# EAGLE board node6.9.14-frontend (EAGLE 5.10), part 1 of 2
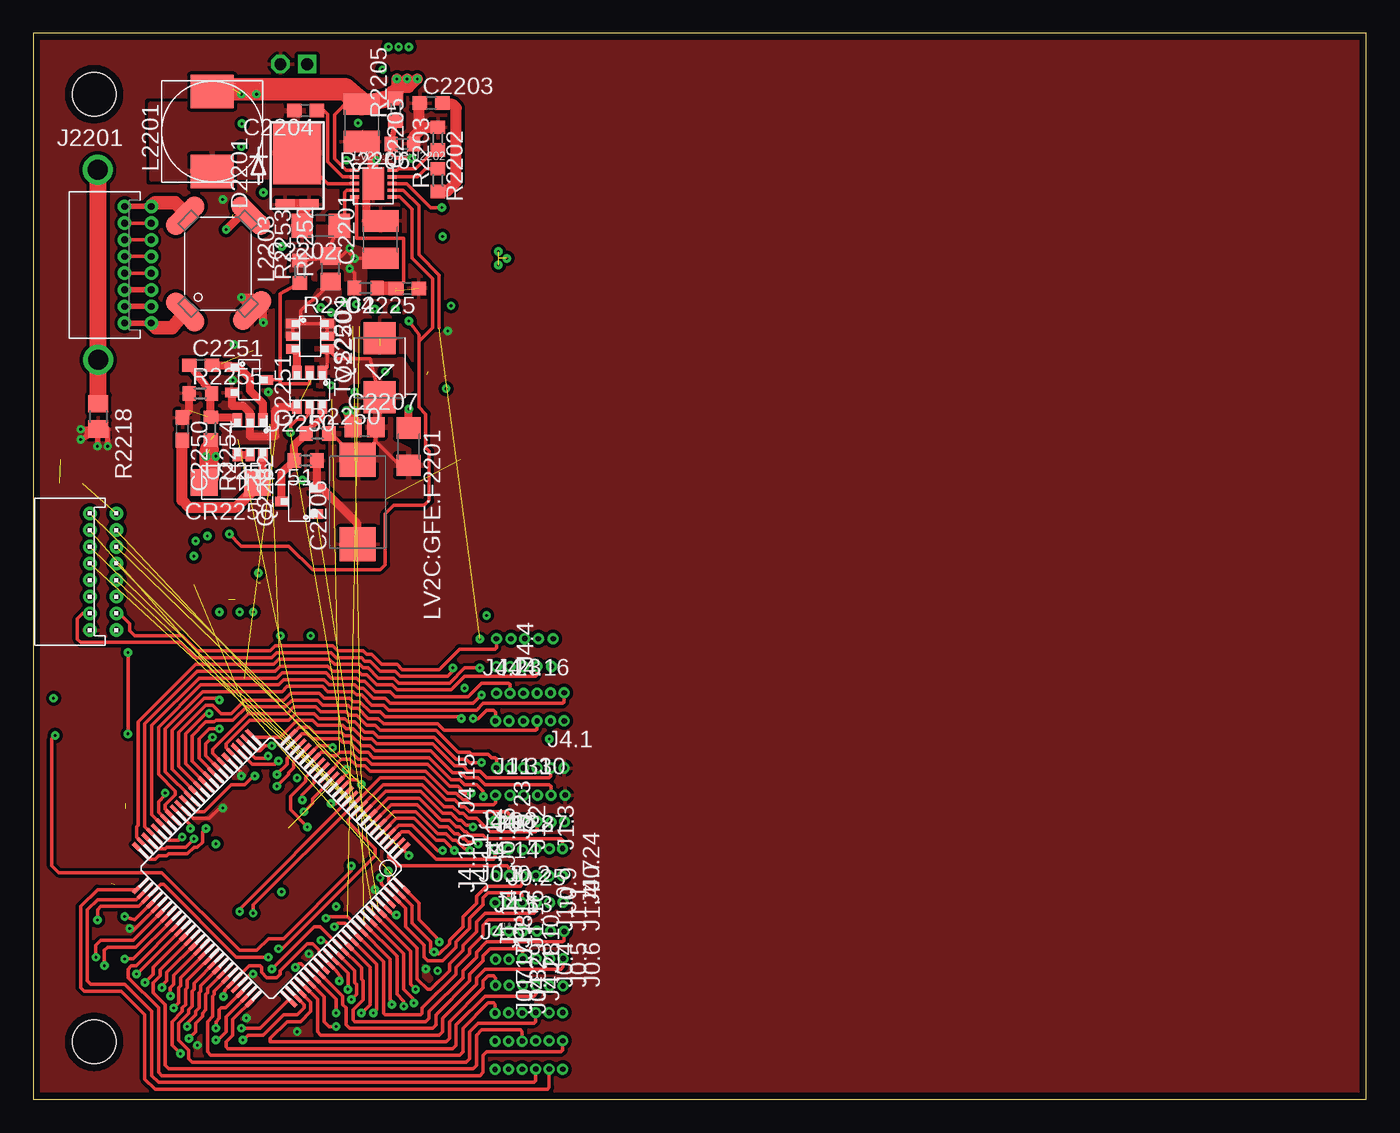
[diagram p2: board, top side]
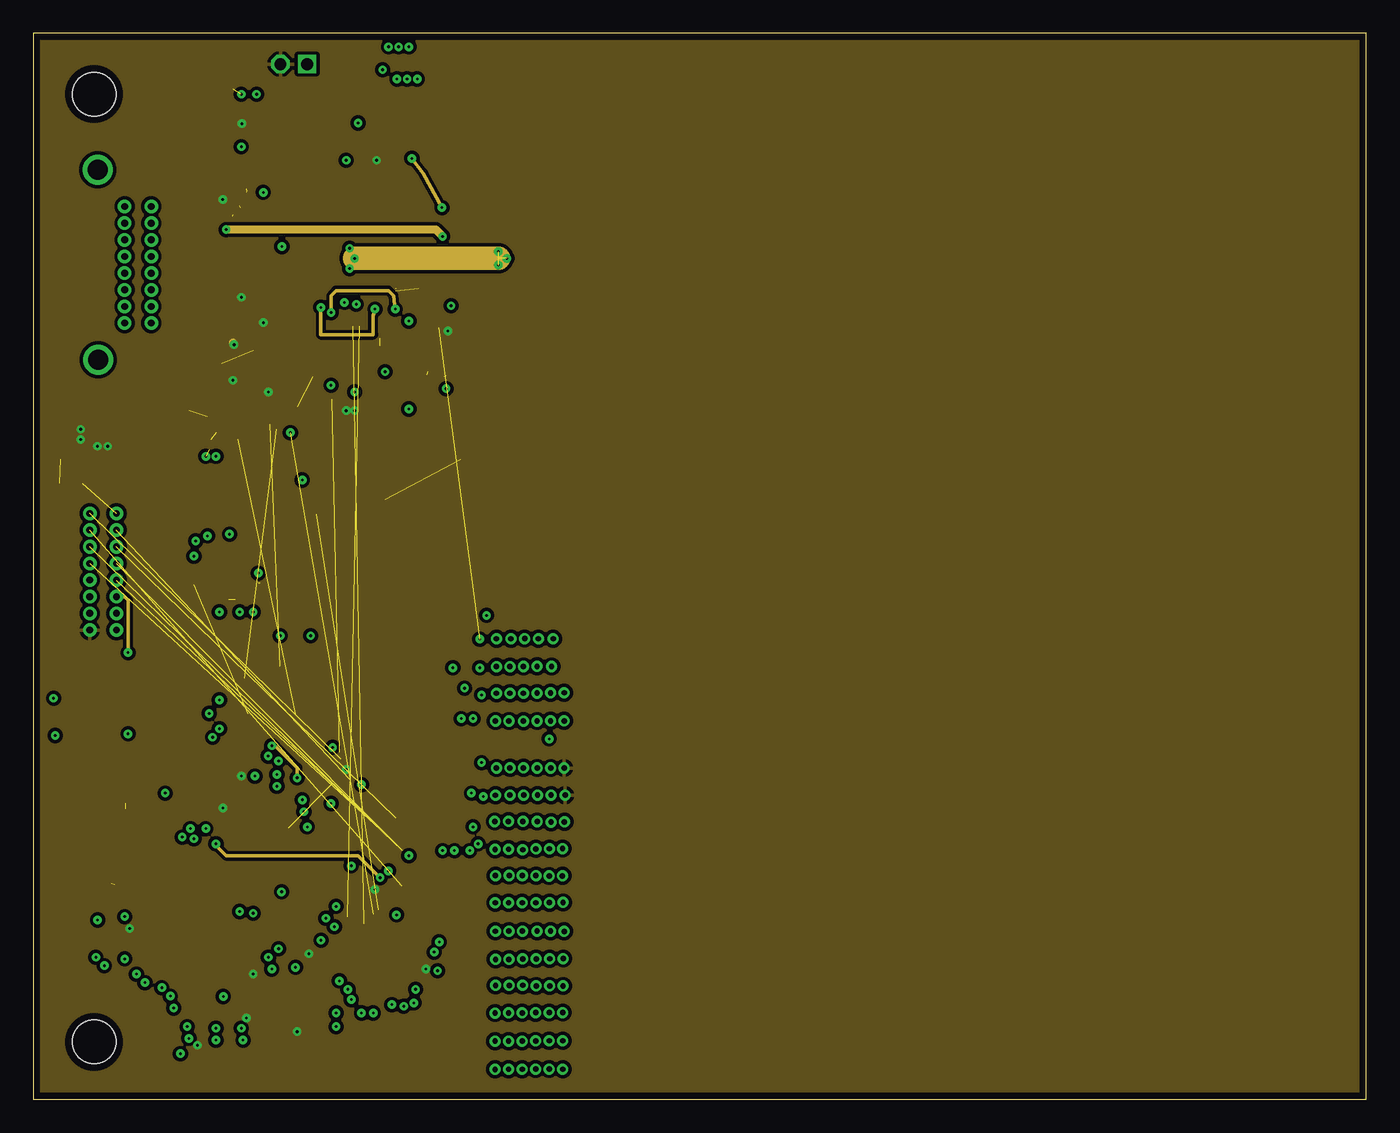
[diagram p3: board, inner layer Route2]
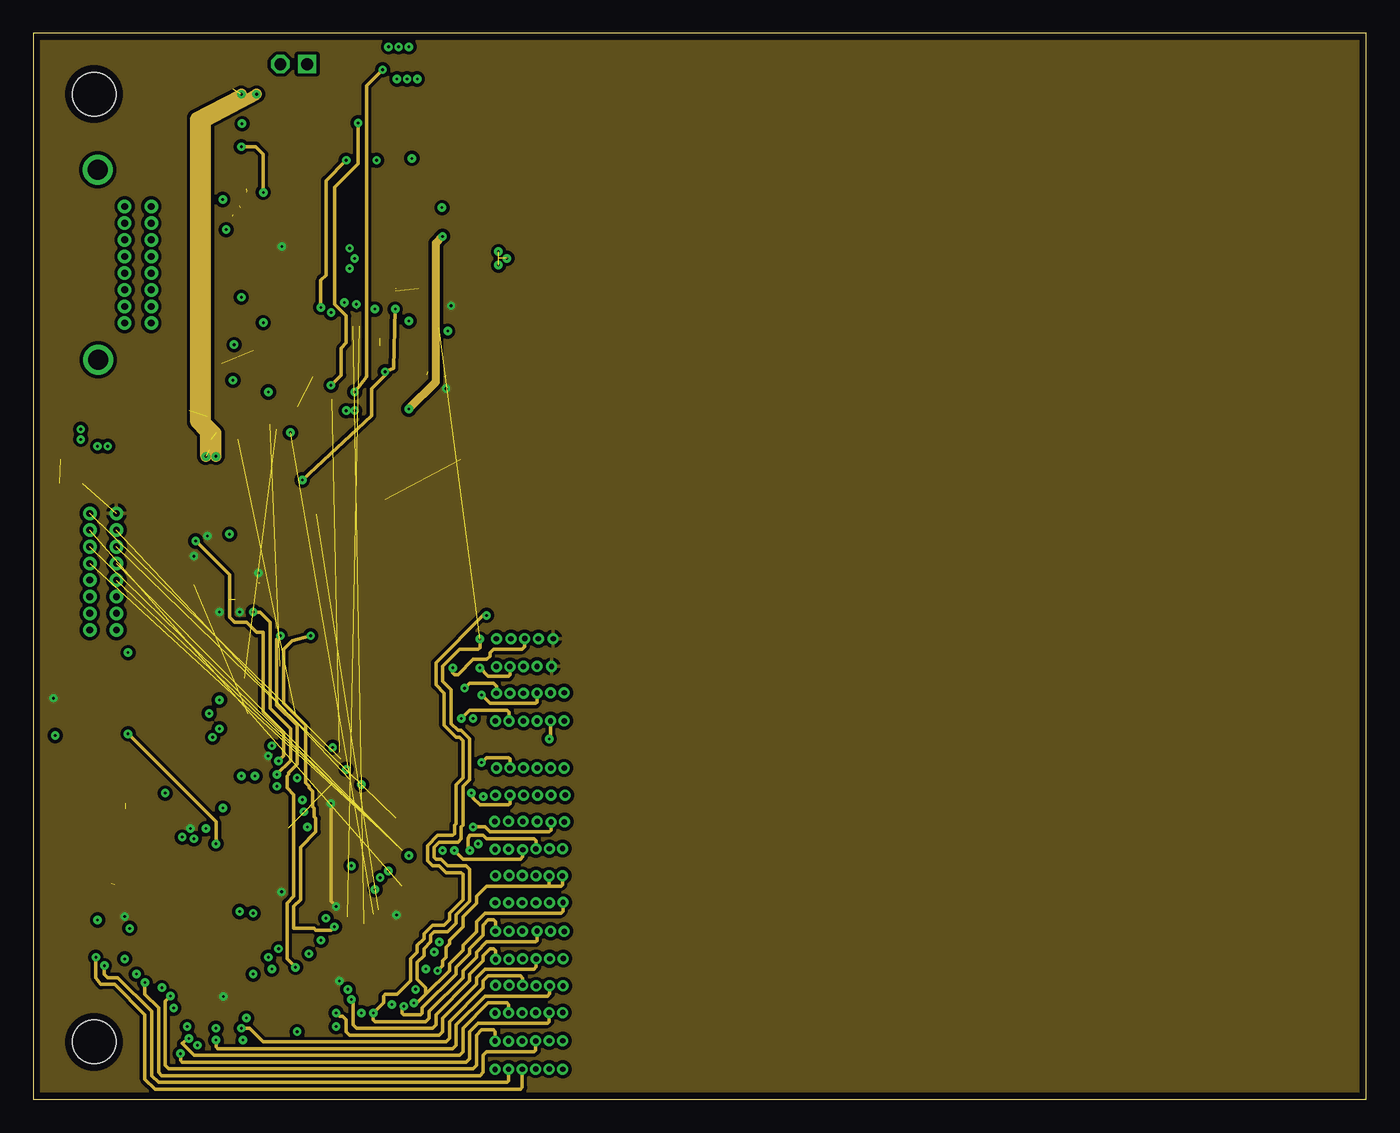
[diagram p4: board, inner layer Route15]
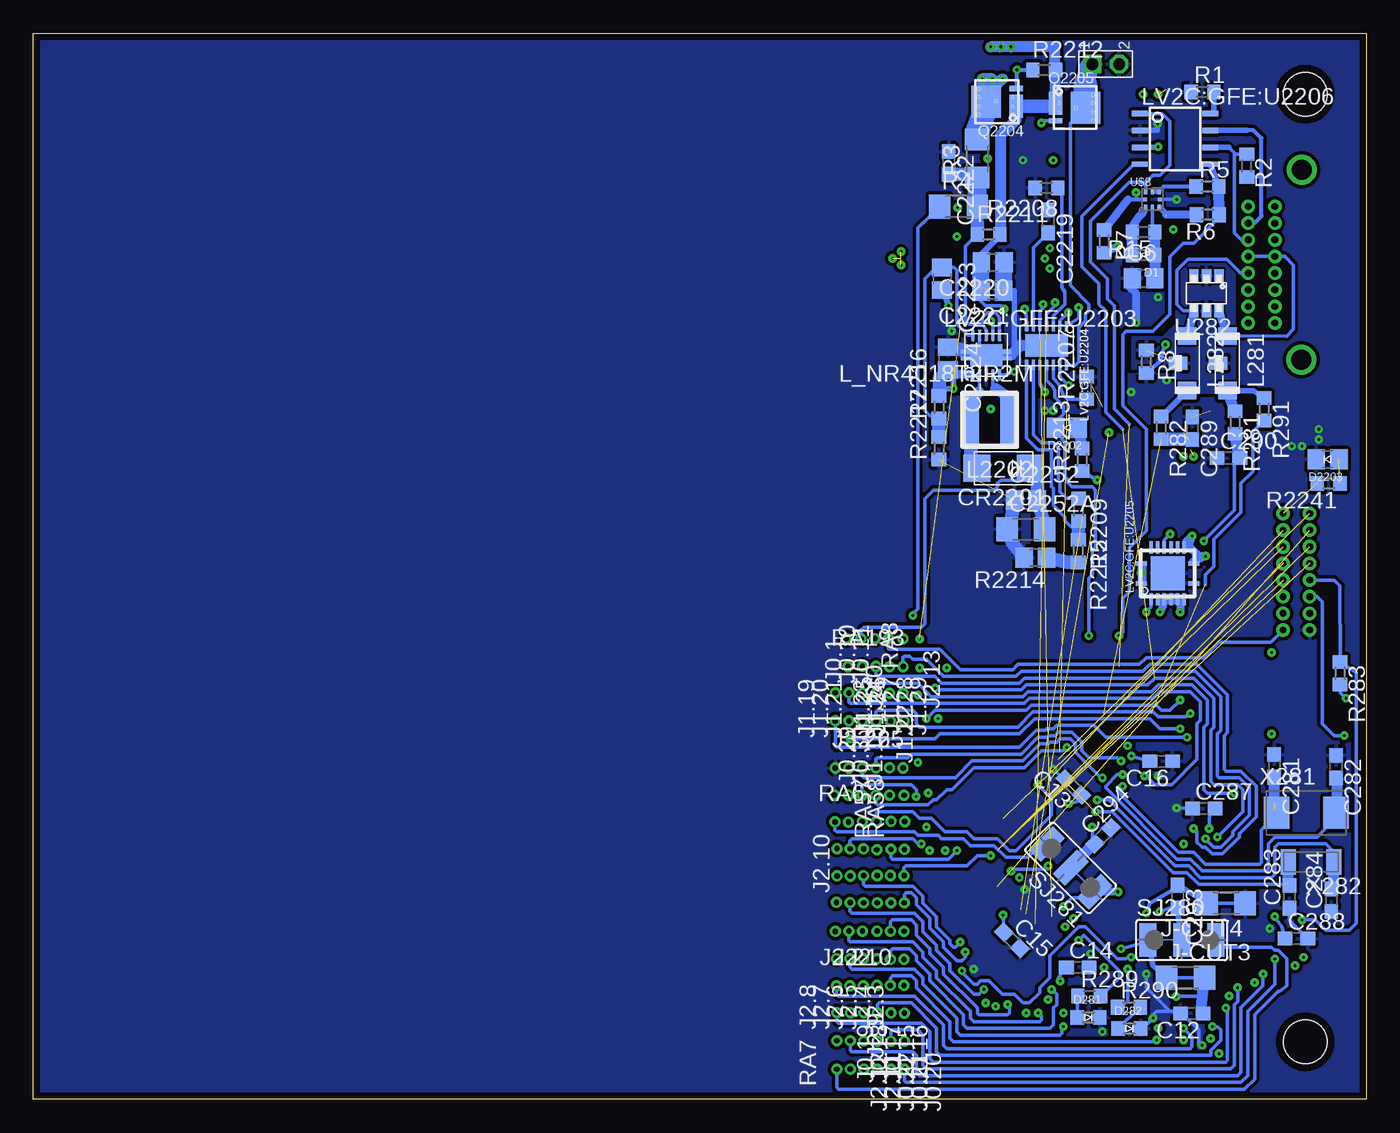
[diagram p5: board, bottom side, seen from below]

Size 100.08 x 80.01 mm. Coordinates in mm from the lower left corner, seen from the top.
Outline: 0,0 100.08,0 100.08,80.01 0,80 0,0
Copper layers (1+2*15+16): Top 0.0432mm / dielectric 0.3048mm / Route2 0.0356mm / dielectric 0.7112mm / Route15 0.0356mm / dielectric 0.3023mm / Bottom 0.0432mm
Design rules "sunstone_4lr_rules_v1.3_modifid *": minimum track width 6mil, minimum drill 8mil, track to track 6mil, track to pad 6mil, pad to pad 6mil, via to via 6mil, smd to smd 6mil, copper to edge 20mil, drill to drill 16mil, minimum pad ring 0.2118mm, minimum via ring 0.2118mm, stop-mask expansion 3mil, vias tented up to drill 0mil, thermal gap 10mil

## Footprints (pad centres in the part's own frame; a part is rotated, then mirrored left to right if it is on the bottom)
2MM-1X2-HEADER = drill 0.889 pad 1.372 square: 1 0,-1 | drill 0.889 pad 1.372 octagon: 2 0,1
C0805 = smd 1.3 x 1.5: 1 -0.85,0; 2 0.85,0
C0603 = smd 1.1 x 1: 1 -0.85,0; 2 0.85,0
C1210 = smd 1.6 x 2.7: 1 -1.4,0; 2 1.4,0
C1206 = smd 1.6 x 1.8: 1 -1.4,0; 2 1.4,0
D/7343-31R = smd 2.55 x 2.7: + 3.175,0; - -3.175,0
NMINIP2-J1 = smd 2 x 2: A 2,0; C -2,0
0603-DIODE = smd 1 x 1.1: A -0.85,0; K 0.85,0
D_POWERDI5 = smd 0.8 x 1.4: ANODE1 -3.47,-0.8; ANODE2 -3.47,1 | smd 4.7 x 3.6: CATHODE 0.4,0.1
0805-DIODE = smd 1.3 x 1.5: 1(ANODE) -0.85,0; 2(CATHODE) 0.85,0
0805-DIODE@1 = smd 1.3 x 1.5: 1(ANODE) -0.85,0; 2(CATHODE) 0.85,0
PAD_ROUND-APC-FREE_0.1/016 = drill 0.406 round: PAD 0,0
ROCKETBUS-PKG = drill 0.508 pad 1.016 round: AUX_1@1 0,-1.875; AUX_1@2 2,-1.875; AUX_2@1 0,-3.125; AUX_2@2 2,-3.125; B+@1 0,4.375; B+@2 2,4.375; B-@1 0,-4.375; B-@2 2,-4.375; CAN_H@1 0,3.125; CAN_H@2 2,3.125; CAN_L@1 0,1.875; CAN_L@2 2,1.875; USB_H@1 0,0.625; USB_H@2 2,0.625; USB_L@1 0,-0.625; USB_L@2 2,-0.625 | drill 1.511 round: CHASSIS@1 -2.032,7.136; CHASSIS@2 -1.982,-7.136
JST-16PS-JED = drill 0.508 pad 1.016 round: 1 4.375,-2; 2 4.375,0; 3 3.125,-2; 4 3.125,0; 5 1.875,-2; 6 1.875,0; 7 0.625,-2; 8 0.625,0; 9 -0.625,-2; 10 -0.625,0; 11 -1.875,-2; 12 -1.875,0; 13 -3.125,-2; 14 -3.125,0; 15 -4.375,-2; 16 -4.375,0
ZJ1206B = smd 1.6 x 1.803: 1 -1.422,0; 2 1.422,0
STAND-OFF = hole 3.302: 0,0
EXC-CET@1 = smd 1.3 x 1.4: 1 -2.05,0; 2 2.05,0 | smd 1 x 1.4: C 0,-0.7
L-DR74 = smd 2.5 x 3.25: 1 -3,0; 2 3,0
L_NR4018 = smd 1.2 x 3.7: 1 -1.4,0; 2 1.4,0
CMS1 = smd 3.5 x 1.5 rotated 45: 1 3.608,-2.462; 3 -3.608,2.462 | smd 3.5 x 1.5 rotated 315: 2 3.508,2.562; 4 -3.608,-2.462
1206 = smd 1.6 x 1.8: 1 -1.4,0; 2 1.4,0
LQFP100 = smd 0.28 x 1.5: #RESET 2,-7.9; #RSTOUT 0.5,-7.9; #TRST -4.5,-7.9; P0[15]/TXD1/SCK0/SCK 0.5,7.9; P0[16]/RXD1/SSEL0/SSEL 0,7.9; P0[17]/CTS1/MISO0/MISO 1,7.9; P0[18]/DCD1/MOSI0/MOSI 1.5,7.9; P0[19]/DSR1/MCICLK/SDA1 2,7.9; P0[20]/DTR1/MCICMD/SCL1 2.5,7.9; P0[21]/RI1/MCIPWR/RD1 3,7.9; P0[22]/RTS1/MCIDAT0/TD1 3.5,7.9; P0[23]/AD0[0]/I2SRX_CLK/CAP3[0] -2,-7.9; P0[24]/AD0[1]/I2SRX_WS/CAP3[1] -2.5,-7.9; P0[25]/AD0[2]/I2SRX_SDA/TXD3 -3,-7.9; P0[26]/AD0[3]/AOUT/RXD3 -3.5,-7.9; P0[27]/SDA0 6,-7.9; P0[28]/SCL0 5.5,-7.9; P1[30]/VBUS/AD0[4] 4,-7.9; P1[31]/SCK1/AD0[5] 3.5,-7.9; P2[0]/PWM1[1]/TXD1/TRACECLK -6,7.9; P2[1]/PWM1[2]/RXD1/PIPESTAT0 -5.5,7.9; P2[2]/PWM1[3]/CTS1/PIPESTAT1 -5,7.9; P2[3]/PWM1[4]/DCD1/PIPESTAT2 -3.5,7.9; P2[4]/PWM1[5]/DSR1/TRACESYNC -3,7.9; P2[5]/PWM1[6]/DTR1/TRACEPKT0 -2.5,7.9; P2[6]/PCAP1[0]/RI1/TRACEPKT1 -2,7.9; P2[7]/RD2/RTS1/TRACEPKT2 -1.5,7.9; P2[8]/TD2/TXD2/TRACEPKT3 -1,7.9; P2[9]/USB_CONNECT/RXD2/EXTIN0 -0.5,7.9; P2[10]/#EINT0 5,7.9; P2[11]/#EINT1/MCIDAT1/I2STX_CLK 5.5,7.9; P2[12]/#EINT2/MCIDAT2/I2STX_WS 6,7.9; RTCX1 1.5,-7.9; RTCX2 2.5,-7.9; TCK -4,-7.9; TDI -5.5,-7.9; TDO -6,-7.9; TMS -5,-7.9; VBAT 3,-7.9; VDD(3V3)@1 4.5,7.9; VDD(3V3)@2 -4,7.9; VDD(DCDC)(3V3) 0,-7.9; VDDA -1.5,-7.9; VREF -0.5,-7.9; VSS 1,-7.9; VSS@3 4,7.9; VSS@4 -4.5,7.9; VSSA -1,-7.9; XTAL1 4.5,-7.9; XTAL2 5,-7.9 | smd 1.5 x 0.28: P0[0]/RD1/TXD3/SDA1 7.9,4; P0[1]/TD1/RXD3/SCL1 7.9,4.5; P0[2]/TXD0 -7.9,-5; P0[3]/RXD0 -7.9,-5.5; P0[4]/I2SRX_CLK/RD2/CAP2[0] -7.9,3.5; P0[5]/I2SRX_WS/TD2/CAP2[1] -7.9,4; P0[6]/I2SRX_SDA/SSEL1/MAT2[0] -7.9,4.5; P0[7]/I2STX_CLK/SCK1/MAT2[1] -7.9,5; P0[8]/I2STX_WS/MISO1/MAT2[2] -7.9,5.5; P0[9]/I2STX_SDA/MOSI1/MAT2[3] -7.9,6; P0[10]/TXD2/SDA2/MAT3[0] 7.9,5; P0[11]/RXD2/SCL2/MAT3[1] 7.9,5.5; P0[29]/USB_D+ 7.9,-4.5; P0[30]/USB_D- 7.9,-4; P1[0]/ENET_TXD0 -7.9,-3.5; P1[1]/ENET_TXD1 -7.9,-3; P1[4]/ENET_TX_EN -7.9,-2.5; P1[8]/ENET_CRS -7.9,-2; P1[9]/ENET_RXD0 -7.9,-1.5; P1[10]/ENET_RXD1 -7.9,-1; P1[14]/ENET_RX_ER -7.9,-0.5; P1[15]/ENET_REF_CLK -7.9,0; P1[16]/ENET_MDC -7.9,0.5; P1[17]/ENET_MDIO -7.9,1; P1[18]/USB_UP_LED/PWM1[1]/CAP1[0] 7.9,-3; P1[19]/CAP1[1] 7.9,-2.5; P1[20]/PWM1[2]/SCK0 7.9,-2; P1[21]/PWM1[3]/SSEL0 7.9,-1.5; P1[22]MAT1[0] 7.9,-1; P1[23]/PWM1[4]/MISO0 7.9,-0.5; P1[24]/PWM1[5]/MOSI0 7.9,0; P1[25]/MAT1[1] 7.9,0.5; P1[26]/PWM1[6]/CAP0[0] 7.9,1; P1[27]/CAP0[1] 7.9,2.5; P1[28]/PCAP1[0]/MAT0[0] 7.9,3; P1[29]/PCAP1[1]/MAT0[1] 7.9,3.5; P2[13]/#EINT3/MCIDAT3/I2STX_SDA 7.9,6; P3[25]/MAT0[0]/PWM1[2] 7.9,-5.5; P3[26]/MAT0[1]/PWM1[3] 7.9,-6; P4[28]/MAT2[0]/TXD3 -7.9,3; P4[29]/MAT2[1]/RXD3 -7.9,1.5; RTCK -7.9,-6; VDD(3V3) 7.9,-5; VDD(3V3)@3 -7.9,-4; VDD(DCDC)(3V3)@1 7.9,2; VDD(DCDC)(3V3)@2 -7.9,2; VSS@1 7.9,-3.5; VSS@2 7.9,1.5; VSS@5 -7.9,-4.5; VSS@6 -7.9,2.5
DFN-10 = smd 0.25 x 0.675: BD -1,-1.413; BOOST -0.5,-1.413; FB 0,1.413; PG 0.5,1.413; RT -1,1.413; RUN/SS 1,-1.413; SW 0,-1.413; SYNC 1,1.413; VC -0.5,1.413; VIN 0.5,-1.413 | smd 2.38 x 1.65: GND 0,0
SON-10 = smd 0.28 x 0.85: EN 1,1.475; FB -1,1.475; GND -0.5,1.475; L1 0.5,-1.475; L2 -0.5,-1.475; PGND 0,-1.475; PS/SYNC 0.5,1.475; VIN 1,-1.475; VINA 0,1.475; VOUT -1,-1.475 | smd 2.4 x 1.65: PGND@1 0,0 | smd 3.8 x 0.28: PGND@2 0,0.25; PGND@3 0,-0.25
DFN-14 = smd 0.25 x 0.7: 1 -1.5,-1.45; 2 -1,-1.45; 3 -0.5,-1.45; 4 0,-1.45; 5 0.5,-1.45; 6 1,-1.45; 7 1.5,-1.45; 8 1.5,1.45; 9 1,1.45; 10 0.5,1.45; 11 0,1.45; 12 -0.5,1.45; 13 -1,1.45; 14 -1.5,1.45 | smd 3.3 x 1.7: PGND 0,0
QFN-16 = smd 0.85 x 0.28: 1 -1.97,-0.75; 8 1.97,-0.74; 9 1.97,0.75; 16 -1.98,0.75 | smd 0.28 x 0.85: 2 -1.25,-1.95; 3 -0.75,-1.95; 4 -0.25,-1.95; 5 0.25,-1.95; 6 0.75,-1.95; 7 1.25,-1.95; 10 1.25,1.95; 11 0.75,1.95; 12 0.25,1.95; 13 -0.25,1.95; 14 -0.75,1.95; 15 -1.25,1.95 | smd 2.55 x 2.55: PGND 0,0
DR-PDSO-G8 = smd 0.4 x 1.2: 1 -1.905,-2.65; 2 -0.635,-2.65; 3 0.635,-2.65; 4 1.905,-2.65; 5 1.905,2.65; 6 0.635,2.65; 7 -0.635,2.65; 8 -1.905,2.65
1212-8_POWERPAK = smd 0.99 x 1.725: 1-2-3 -1.45,0.33 | smd 0.99 x 0.405: 4 -1.45,-0.99 | smd 2.24 x 2.39: 5-6-7-8 0.797,0
SOT23-6 = smd 0.7 x 1: 1 -0.95,-1.3; 2 0,-1.3; 3 0.95,-1.3; 4 0.95,1.3; 5 0,1.3; 6 -0.95,1.3
SOT23-3 = smd 0.7 x 1: 1 -0.95,-1.3; 2 0.95,-1.3; 3 0,1.3
R0603 = smd 1 x 1.1: 1 -0.85,0; 2 0.85,0
R1206 = smd 1.6 x 1.803: 1 -1.422,0; 2 1.422,0
R0805 = smd 1.3 x 1.5: 1 -0.85,0; 2 0.85,0
R0805' = smd 1.3 x 1.5: 1 -0.95,0; 2 0.95,0
SJ_2W = smd 1.27 x 2.54: 1 -2.54,0; 2 0,0; 3 2.54,0
SMB = smd 2.4 x 2.4: A 2.2,0; C -2.2,0
MICROPAK-8 = smd 0.25 x 0.4: 1 -0.5,-0.61; 2 0,-0.61; 3 0.5,-0.61; 5 0.5,0.61; 6 0,0.61; 7 -0.5,0.61 | smd 0.4 x 0.25: 4 0.6,0; 8 -0.6,0
CS10 = smd 1.905 x 2.413: P$1 -2.235,0; P$2 2.235,0
CM415 = smd 1.118 x 1.905: P$1 -1.702,0; P$2 1.702,0

## Placement (x,y rotation side)
B1  BATTERY_SINGLE_CELL_2MM  [2MM-1X2-HEADER]  19.56,77.7 270 bottom
C6  76nF  [C0805]  16.71,61.62 0 bottom
C12  0.1  [C0603]  13.09,6.45 180 bottom
C13  0.1  [C0603]  22,23.44 135 bottom
C14  0.1  [C0603]  21.67,9.91 0 bottom
C15  0.1  [C0603]  26.61,11.94 315 bottom
C16  0.1  [C0603]  15.39,25.37 180 bottom
C281  39 pF  [C0603]  6.91,25.02 270 bottom
C282  33 pF  [C0603]  2.26,24.97 270 bottom
C283  22 pF  [C0603]  5.77,15.19 90 bottom
C284  22 pF  [C0603]  2.62,14.94 90 bottom
C287  0.1  [C0603]  12.19,21.82 0 bottom
C288  0.1  [C0603]  5.23,12.06 0 bottom
C289  18pF  [C0603]  13.06,50.37 270 bottom
C290  18pF  [C0603]  10.34,48.13 0 bottom
C293  0.1  [C0603]  14.17,15.21 270 bottom
C294  0.1  [C0603]  19.78,19.77 45 bottom
C2201  10uF  [C1210]  26.06,64.53 90 top
C2202  1uF  [C1206]  21.59,65.56 180 top
C2203  680pF  [C0603]  29.87,74.77 0 top
C2204  0.22uF  [C0603]  20.44,74.22 180 top
C2205  22uF  [C1210]  24.67,73.28 270 top
C2206  22  [D/7343-31R]  24.35,44.83 90 top
C2207  0.33  [C0805]  24.87,50.44 0 top
C2219  depends on bat  [C0603]  23.88,65.89 270 bottom
C2220  4.7uF  [C0805]  28.04,62.81 180 bottom
C2221  4.7uF  [C0805]  28.07,60.71 180 bottom
C2222  0.1uF  [C0603]  31.34,70.28 270 bottom
C2223  2pF  [C0805]  31.85,61.59 270 bottom
C2224  22uF  [C0805]  31.42,55.6 270 bottom
C2225  0.1uF  [C0603]  28.09,60.86 180 top
C2250  2.7  [C0603]  11.2,50.32 270 top
C2251  0.015  [C0603]  12.57,55.09 0 top
C2252  TBD  [C0805]  25.55,44.98 0 bottom
C2252A  TBD  [C1206]  25.55,42.8 0 bottom
CR2201  MA2Q705  [NMINIP2-J1]  27.23,47.37 180 bottom
CR2250  MA2Q705  [NMINIP2-J1]  14.83,46.3 180 top
D1  CDSU101A  [0603-DIODE]  16.71,63.37 180 bottom
D281  LED-RED-0603  [0603-DIODE]  20.85,6.15 0 bottom
D282  LED-GRN-  [0603-DIODE]  17.78,5.31 0 bottom
D2201  D_PDS340  [D_POWERDI5]  19.91,70.63 90 top
D2202  LED-RED-0805  [0805-DIODE]  22.48,50.39 180 bottom
D2203  LED-ORG-0805  [0805-DIODE@1]  2.9,48.03 180 bottom
J0.0  PAD_ROUND016  [PAD_ROUND-APC-FREE_0.1/016]  34.77,30.48 90 bottom
J0.1  PAD_ROUND016  [PAD_ROUND-APC-FREE_0.1/016]  37.82,32.5 90 bottom
J0.2  PAD_ROUND016  [PAD_ROUND-APC-FREE_0.1/016]  36.7,14.76 0 top
J0.3  PAD_ROUND016  [PAD_ROUND-APC-FREE_0.1/016]  34.68,14.76 0 top
J0.4  PAD_ROUND016  [PAD_ROUND-APC-FREE_0.1/016]  37.76,10.54 270 top
J0.5  PAD_ROUND016  [PAD_ROUND-APC-FREE_0.1/016]  38.77,10.55 270 top
J0.6  PAD_ROUND016  [PAD_ROUND-APC-FREE_0.1/016]  39.79,10.57 270 top
J0.7  PAD_ROUND016  [PAD_ROUND-APC-FREE_0.1/016]  34.71,8.55 270 top
J0.8  PAD_ROUND016  [PAD_ROUND-APC-FREE_0.1/016]  35.73,8.55 270 top
J0.9  PAD_ROUND016  [PAD_ROUND-APC-FREE_0.1/016]  36.74,8.56 270 top
J0.10  PAD_ROUND016  [PAD_ROUND-APC-FREE_0.1/016]  36.8,32.49 90 bottom
J0.11  PAD_ROUND016  [PAD_ROUND-APC-FREE_0.1/016]  35.79,32.47 90 bottom
J0.15  PAD_ROUND016  [PAD_ROUND-APC-FREE_0.1/016]  36.7,4.37 270 bottom
J0.16  PAD_ROUND016  [PAD_ROUND-APC-FREE_0.1/016]  35.69,4.37 270 bottom
J0.17  PAD_ROUND016  [PAD_ROUND-APC-FREE_0.1/016]  37.72,4.38 270 bottom
J0.18  PAD_ROUND016  [PAD_ROUND-APC-FREE_0.1/016]  38.73,4.39 270 bottom
J0.19  PAD_ROUND016  [PAD_ROUND-APC-FREE_0.1/016]  39.75,4.39 270 bottom
J0.20  PAD_ROUND016  [PAD_ROUND-APC-FREE_0.1/016]  34.67,2.25 270 bottom
J0.21  PAD_ROUND016  [PAD_ROUND-APC-FREE_0.1/016]  35.69,2.26 270 bottom
J0.22  PAD_ROUND016  [PAD_ROUND-APC-FREE_0.1/016]  36.7,2.26 270 bottom
J0.23  PAD_ROUND016  [PAD_ROUND-APC-FREE_0.1/016]  38.87,20.8 90 top
J0.24  PAD_ROUND016  [PAD_ROUND-APC-FREE_0.1/016]  39.74,18.82 270 top
J0.25  PAD_ROUND016  [PAD_ROUND-APC-FREE_0.1/016]  38.75,18.81 180 top
J0.26  PAD_ROUND016  [PAD_ROUND-APC-FREE_0.1/016]  37.73,18.8 90 top
J0.27  PAD_ROUND016  [PAD_ROUND-APC-FREE_0.1/016]  38.87,22.83 180 top
J0.28  PAD_ROUND016  [PAD_ROUND-APC-FREE_0.1/016]  37.86,22.83 180 top
J0.29  PAD_ROUND016  [PAD_ROUND-APC-FREE_0.1/016]  36.8,24.88 90 bottom
J0.30  PAD_ROUND016  [PAD_ROUND-APC-FREE_0.1/016]  35.79,24.88 90 bottom
J1.0  PAD_ROUND016  [PAD_ROUND-APC-FREE_0.1/016]  37.74,14.75 270 top
J1.1  PAD_ROUND016  [PAD_ROUND-APC-FREE_0.1/016]  38.76,14.76 270 top
J1.2  PAD_ROUND016  [PAD_ROUND-APC-FREE_0.1/016]  35.67,20.87 270 top
J1.3  PAD_ROUND016  [PAD_ROUND-APC-FREE_0.1/016]  37.83,20.85 270 top
J1.4  PAD_ROUND016  [PAD_ROUND-APC-FREE_0.1/016]  39.77,14.78 270 top
J1.8  PAD_ROUND016  [PAD_ROUND-APC-FREE_0.1/016]  34.69,12.62 270 top
J1.9  PAD_ROUND016  [PAD_ROUND-APC-FREE_0.1/016]  35.71,12.63 270 top
J1.10  PAD_ROUND016  [PAD_ROUND-APC-FREE_0.1/016]  36.72,12.63 270 top
J1.14  PAD_ROUND016  [PAD_ROUND-APC-FREE_0.1/016]  37.82,12.62 90 top
J1.15  PAD_ROUND016  [PAD_ROUND-APC-FREE_0.1/016]  38.84,12.62 90 top
J1.16  PAD_ROUND016  [PAD_ROUND-APC-FREE_0.1/016]  39.85,12.61 90 top
J1.17  PAD_ROUND016  [PAD_ROUND-APC-FREE_0.1/016]  34.71,10.5 270 top
J1.18  PAD_ROUND016  [PAD_ROUND-APC-FREE_0.1/016]  34.77,24.87 90 bottom
J1.19  PAD_ROUND016  [PAD_ROUND-APC-FREE_0.1/016]  39.85,28.41 90 bottom
J1.20  PAD_ROUND016  [PAD_ROUND-APC-FREE_0.1/016]  38.84,28.41 90 bottom
J1.21  PAD_ROUND016  [PAD_ROUND-APC-FREE_0.1/016]  37.82,28.4 90 bottom
J1.22  PAD_ROUND016  [PAD_ROUND-APC-FREE_0.1/016]  36.8,28.38 270 bottom
J1.23  PAD_ROUND016  [PAD_ROUND-APC-FREE_0.1/016]  35.71,28.4 90 bottom
J1.24  PAD_ROUND016  [PAD_ROUND-APC-FREE_0.1/016]  34.7,28.4 90 bottom
J1.25  PAD_ROUND016  [PAD_ROUND-APC-FREE_0.1/016]  39.85,30.52 270 bottom
J1.26  PAD_ROUND016  [PAD_ROUND-APC-FREE_0.1/016]  38.84,30.51 270 bottom
J1.27  PAD_ROUND016  [PAD_ROUND-APC-FREE_0.1/016]  37.82,30.49 270 bottom
J1.28  PAD_ROUND016  [PAD_ROUND-APC-FREE_0.1/016]  36.8,30.48 270 bottom
J1.29  PAD_ROUND016  [PAD_ROUND-APC-FREE_0.1/016]  35.79,30.48 270 bottom
J1.30  PAD_ROUND016  [PAD_ROUND-APC-FREE_0.1/016]  36.82,22.83 0 top
J1.31  PAD_ROUND016  [PAD_ROUND-APC-FREE_0.1/016]  35.79,22.83 0 top
J2.0  PAD_ROUND016  [PAD_ROUND-APC-FREE_0.1/016]  37.76,8.51 0 bottom
J2.1  PAD_ROUND016  [PAD_ROUND-APC-FREE_0.1/016]  38.77,8.51 0 bottom
J2.2  PAD_ROUND016  [PAD_ROUND-APC-FREE_0.1/016]  39.78,8.51 0 bottom
J2.3  PAD_ROUND016  [PAD_ROUND-APC-FREE_0.1/016]  34.67,6.48 90 bottom
J2.4  PAD_ROUND016  [PAD_ROUND-APC-FREE_0.1/016]  35.69,6.49 90 bottom
J2.5  PAD_ROUND016  [PAD_ROUND-APC-FREE_0.1/016]  36.7,6.49 90 bottom
J2.6  PAD_ROUND016  [PAD_ROUND-APC-FREE_0.1/016]  37.72,6.5 90 bottom
J2.7  PAD_ROUND016  [PAD_ROUND-APC-FREE_0.1/016]  38.73,6.52 90 bottom
J2.8  PAD_ROUND016  [PAD_ROUND-APC-FREE_0.1/016]  39.75,6.52 90 bottom
J2.9  PAD_ROUND016  [PAD_ROUND-APC-FREE_0.1/016]  34.67,4.37 90 bottom
J2.10  PAD_ROUND016  [PAD_ROUND-APC-FREE_0.1/016]  38.73,16.76 90 bottom
J2.11  PAD_ROUND016  [PAD_ROUND-APC-FREE_0.1/016]  37.72,2.27 270 bottom
J2.12  PAD_ROUND016  [PAD_ROUND-APC-FREE_0.1/016]  38.73,2.27 270 bottom
J2.13  PAD_ROUND016  [PAD_ROUND-APC-FREE_0.1/016]  34.77,32.47 270 bottom
J3.25  PAD_ROUND016  [PAD_ROUND-APC-FREE_0.1/016]  37.83,24.87 0 bottom
J3.26  PAD_ROUND016  [PAD_ROUND-APC-FREE_0.1/016]  38.85,24.87 0 bottom
J4.1  PAD_ROUND016  [PAD_ROUND-APC-FREE_0.1/016]  39.85,24.87 0 top
J4.2  PAD_ROUND016  [PAD_ROUND-APC-FREE_0.1/016]  35.86,34.57 180 top
J4.3  PAD_ROUND016  [PAD_ROUND-APC-FREE_0.1/016]  36.89,34.58 180 top
J4.4  PAD_ROUND016  [PAD_ROUND-APC-FREE_0.1/016]  34.77,34.57 270 top
J4.5  PAD_ROUND016  [PAD_ROUND-APC-FREE_0.1/016]  36.72,16.8 180 top
J4.6  PAD_ROUND016  [PAD_ROUND-APC-FREE_0.1/016]  35.69,14.76 180 top
J4.7  PAD_ROUND016  [PAD_ROUND-APC-FREE_0.1/016]  39.73,16.78 270 top
J4.8  PAD_ROUND016  [PAD_ROUND-APC-FREE_0.1/016]  35.69,18.77 0 top
J4.9  PAD_ROUND016  [PAD_ROUND-APC-FREE_0.1/016]  34.67,18.76 0 top
J4.10  PAD_ROUND016  [PAD_ROUND-APC-FREE_0.1/016]  34.7,16.79 90 top
J4.11  PAD_ROUND016  [PAD_ROUND-APC-FREE_0.1/016]  35.73,16.8 90 top
J4.12  PAD_ROUND016  [PAD_ROUND-APC-FREE_0.1/016]  36.74,18.73 90 top
J4.13  PAD_ROUND016  [PAD_ROUND-APC-FREE_0.1/016]  37.74,16.79 180 top
J4.14  PAD_ROUND016  [PAD_ROUND-APC-FREE_0.1/016]  36.77,20.87 180 top
J4.15  PAD_ROUND016  [PAD_ROUND-APC-FREE_0.1/016]  34.7,22.82 90 top
J4.16  PAD_ROUND016  [PAD_ROUND-APC-FREE_0.1/016]  39.03,34.57 180 top
J4.28  PAD_ROUND016  [PAD_ROUND-APC-FREE_0.1/016]  36.74,10.54 270 top
J4.29  PAD_ROUND016  [PAD_ROUND-APC-FREE_0.1/016]  35.71,10.5 270 top
J2201  ROCKETBUS  [ROCKETBUS-PKG]  6.86,62.64 0 top
J2204  JST-16PS-JED  [JST-16PS-JED]  4.24,39.6 90 top
J-CUT3  J_CUT_1206  [ZJ1206B]  13.56,9.12 0 bottom
J-CUT4  J_CUT_1206  [ZJ1206B]  10.52,14.73 180 bottom
JP1  STAND-OFF  [STAND-OFF]  4.57,75.44 0 top
JP2  STAND-OFF  [STAND-OFF]  4.57,4.32 0 top
L281  EXC-CET471U  [EXC-CET@1]  10.41,55.24 270 bottom
L282  FILTER_EMI-EXC-CET  [EXC-CET@1]  13.44,55.24 270 bottom
L2201  L_DR74-6R8-R  [L-DR74]  13.43,72.64 90 top
L2202  L_NR4018T2R2M  [L_NR4018]  28.27,51.01 180 bottom
L2203  CMS1  [CMS1]  13.87,62.71 270 top
LV2C:GFE:F2201  2.0A Fast  [1206]  28.17,49 270 top
LV2C:GFE:U2201  IC_LPC2368  [LQFP100]  17.86,17.35 135 top
LV2C:GFE:U2202  IC_LT3972  [DFN-10]  25.52,68.74 270 top
LV2C:GFE:U2203  IC_TPS63000  [SON-10]  28.53,55.86 0 bottom
LV2C:GFE:U2204  IC_LTC4085  [DFN-14]  24,56.56 180 bottom
LV2C:GFE:U2205  IC_SN74LV163A  [QFN-16]  14.91,39.47 0 bottom
LV2C:GFE:U2206  IC_SN65HVD235  [DR-PDSO-G8]  14.35,72.09 270 bottom
Q2204  P-MOS_SI7123DN  [1212-8_POWERPAK]  27.73,74.87 180 bottom
Q2205  P-MOS_SI7123DN  [1212-8_POWERPAK]  21.86,74.43 0 bottom
Q2250  ZXMP6A17E6TA  [SOT23-6]  20.78,57.28 270 top
Q2251  BSS123E6327  [SOT23-3]  16.21,54 270 top
Q2282  BSS123E6327  [SOT23-3]  19.96,44.88 90 top
R1  18k  [R0603]  12.29,75.62 0 bottom
R2  60  [R0603]  8.97,70.08 270 bottom
R3  100k  [R1206]  29.21,70.61 90 bottom
R4  100k  [R1206]  30.61,67.01 0 bottom
R5  0  [R0603]  11.91,68.5 0 bottom
R6  0  [R0603]  11.89,66.4 180 bottom
R7  0  [R0603]  19.68,64.39 270 bottom
R8  0  [R0603]  16.51,55.37 270 bottom
R15  10k  [R0603]  16.71,65.1 180 bottom
R281  33.2  [R0603]  9.86,50.8 270 bottom
R282  33.2  [R0603]  15.39,50.39 270 bottom
R283  10.0k  [R0603]  1.96,31.98 270 bottom
R289  649  [R0603]  20.8,7.75 0 bottom
R290  649  [R0603]  17.81,6.91 0 bottom
R291  1.5k  [R0603]  7.67,51.79 270 bottom
R2202  26.7k  [R0603]  30.37,72.11 270 top
R2203  15k  [R0603]  30.38,68.99 90 top
R2204  500k  [R0603]  24.97,60.89 180 top
R2205  532k  [R0603]  27.21,74.27 90 top
R2206  100k  [R0603]  27.71,71.71 180 top
R2207  100k  [R0603]  20.98,53.39 90 bottom
R2208  660  [R0603]  24,68.4 180 bottom
R2209  115k 1%  [R0603]  21.59,44.25 270 bottom
R2211  100  [R0603]  28.35,64.92 0 bottom
R2212  1k  [R0603]  24.18,77.27 0 bottom
R2213  510  [R0603]  21.34,48.01 90 bottom
R2214  Thermistor-100k @25C  [R0805]  24.84,40.64 180 bottom
R2215  15k 1%  [R0603]  21.62,41.15 270 bottom
R2216  1.0M  [R0603]  32.08,51.94 90 bottom
R2217  200k  [R0603]  32.08,48.87 90 bottom
R2218  100k  [R0805']  4.88,51.26 270 top
R2241  649  [R0603]  2.82,46.23 180 bottom
R2250  61.9k  [R0603]  21.34,49.97 0 top
R2251  10.0k  [R0603]  20.45,47.94 180 top
R2252  0.82  [R0805']  22.32,62.34 90 top
R2253  47k  [R0603]  20.02,62.12 90 top
R2254  33.0k  [R0603]  13.34,50.34 270 top
R2255  10.0k  [R0603]  12.55,52.98 0 top
RA6  t24  [PAD_ROUND-APC-FREE_0.1/016]  39.88,20.83 0 bottom
RA7  t24  [PAD_ROUND-APC-FREE_0.1/016]  39.75,2.26 90 bottom
RA8  t24  [PAD_ROUND-APC-FREE_0.1/016]  37.92,34.57 270 bottom
RA57  t24  [PAD_ROUND-APC-FREE_0.1/016]  39.93,22.83 270 bottom
RA58  t24  [PAD_ROUND-APC-FREE_0.1/016]  34.65,20.85 90 bottom
RA193  3P3  [PAD_ROUND-APC-FREE_0.1/016]  38.91,32.49 0 bottom
SJ280  [SJ_2W]  13.84,11.96 0 bottom
SJ281  [SJ_2W]  22.19,17.37 135 bottom
TVS2201  SMBJ18A  [SMB]  26,54.91 90 top
U282  SN65220DBVR  [SOT23-6]  11.99,60.5 180 bottom
U2250  MAX5902AAETT  [SOT23-6]  20.75,53.26 180 top
U2251  TLV3012AIDBVT  [SOT23-6]  16.28,49.68 180 top
U$8  IC_NC7NP14  [MICROPAK-8]  16.05,67.54 0 bottom
X281  12.0 MHz  [CS10]  4.5,21.51 0 bottom
X282  32.768 kHz  [CM415]  4.14,17.81 180 bottom